# EAGLE design ESPRGBLED (EAGLE 7.4.0)
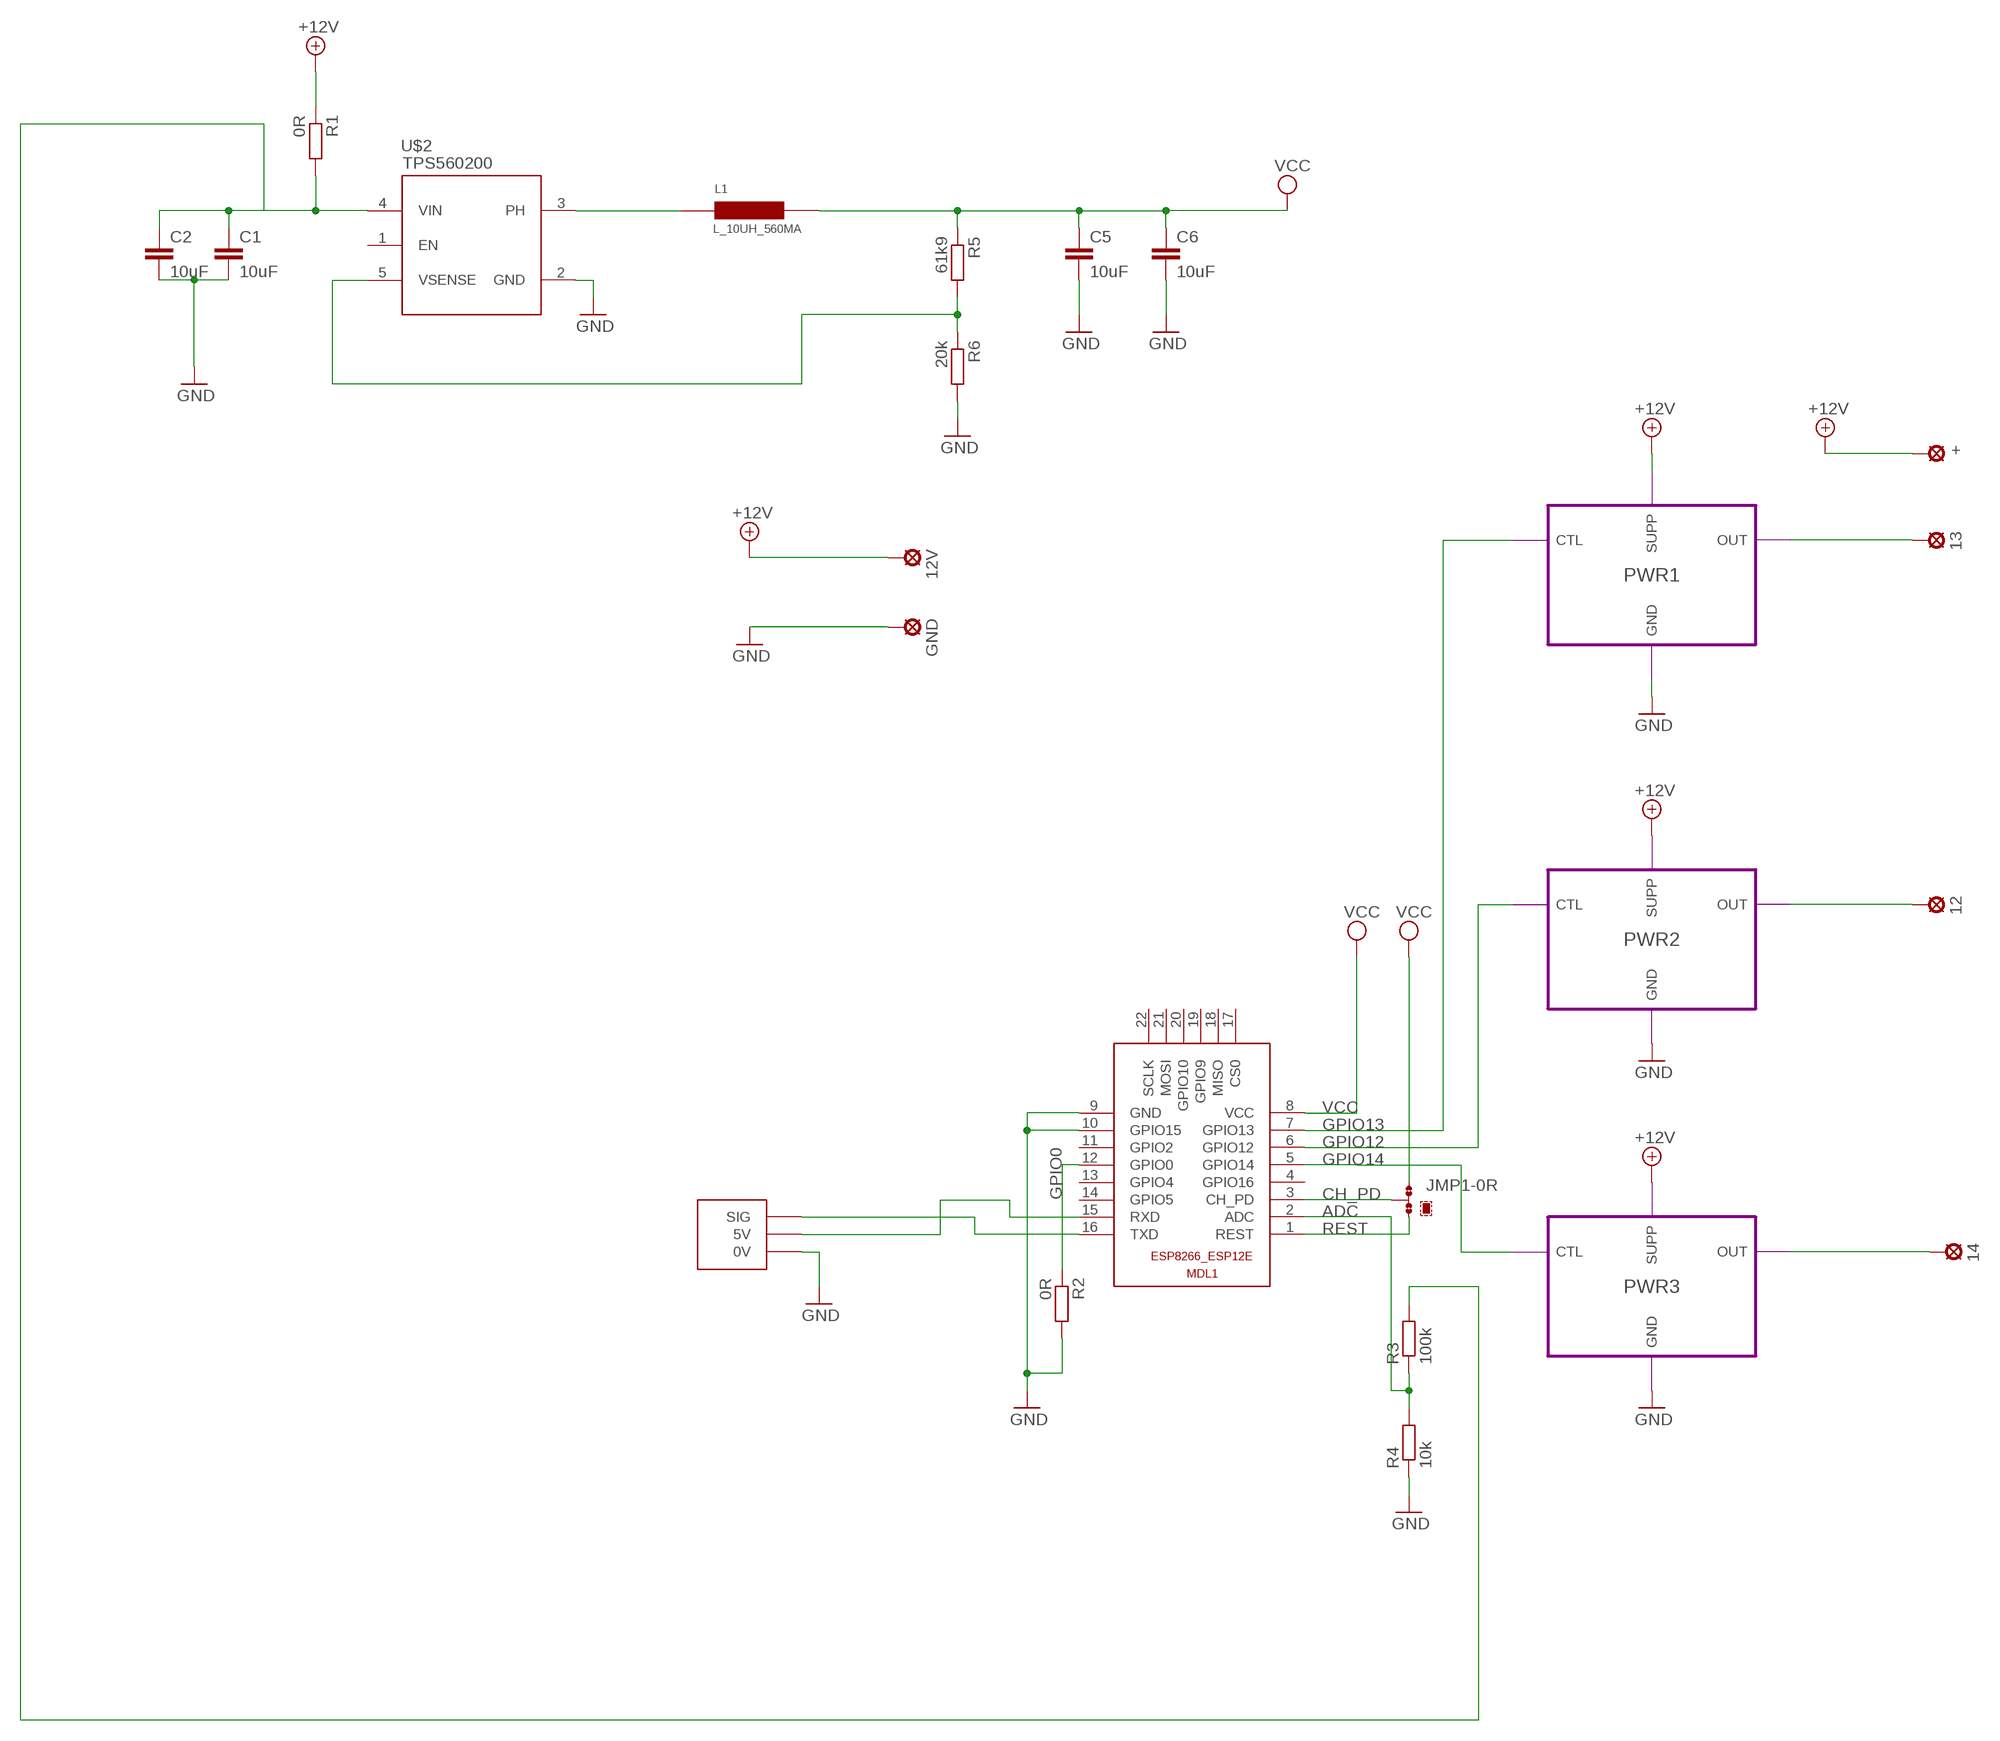
[diagram p0: schematic, sheet 1]

## Parts
12  LSP10  [LSP10]
12V  LSP10  [LSP10]
13  LSP10  [LSP10]
14  LSP10  [LSP10]
+  LSP10  [LSP10]
C1  10uF  C-EUC0805K  [C0805K]
C2  10uF  C-EUC0805K  [C0805K]
C5  10uF  C-EUC0805K  [C0805K]
C6  10uF  C-EUC0805K  [C0805K]
GND  LSP10  [LSP10]
JMP1  0R-JUMPC  [C0R-JMP]
L1  L_10UH_560MA  [TYS3010100M-10]
MDL1  ESP8266-12EESP8266-ESP12E  [ESP8266-ESP12E]
R1  0R  R-EU_R0402  [R0402]
R2  0R  R-EU_R0805  [R0805]
R3  100k  R-EU_R0603  [R0603]
R4  10k  R-EU_R0603  [R0603]
R5  61k9  R-EU_R0402  [R0402]
R6  20k  R-EU_R0402  [R0402]
U$2  TPS560200  [SOT23-5]
U$3  3-WIRE_CONNWIRE  [3-WIRE_CONN]

## Module instances
PWR1 = POWER_N
PWR2 = POWER_N
PWR3 = POWER_N

## Nets
+12V [power]: 12V.MP +.MP R1.1 ; port PWR1.SUPP PWR2.SUPP PWR3.SUPP
ADC: MDL1.2(ADC) R3.1 R4.2
CH_PD: JMP1.2 MDL1.3(CH_PD)
GND: C1.2 C2.2 C5.2 C6.2 GND.MP MDL1.9(GND) MDL1.10(GPIO15) R2.2 R4.1 R6.2 U$2.2(GND) U$3.0V ; port PWR1.GND PWR2.GND PWR3.GND
GPIO0: MDL1.12(GPIO0) R2.1
GPIO12: MDL1.6(GPIO12) ; port PWR2.CTL
GPIO13: MDL1.7(GPIO13) ; port PWR1.CTL
GPIO14: MDL1.5(GPIO14) ; port PWR3.CTL
N$1 [power]: 13.MP ; port PWR1.OUT
N$4 [power]: 12.MP ; port PWR2.OUT
N$5 [power]: 14.MP ; port PWR3.OUT
N$7: MDL1.16(TXD) U$3.SIG
N$8: MDL1.15(RXD) U$3.5V
N$13: L1.P$1 U$2.3(PH)
N$15: R5.2 R6.1 U$2.5(VSENSE)
REST: JMP1.1 MDL1.1(REST)
VCC: C5.1 C6.1 JMP1.3 L1.P$2 MDL1.8(VCC) R5.1
VIN: C1.1 C2.1 R1.2 R3.2 U$2.4(VIN)
Unconnected: MDL1.4(GPIO16) MDL1.11(GPIO2) MDL1.13(GPIO4) MDL1.14(GPIO5) MDL1.17(CS0) MDL1.18(MISO) MDL1.19(GPIO9) MDL1.20(GPIO10) MDL1.21(MOSI) MDL1.22(SCLK) U$2.1(EN)

## Library data of the parts
12 12V 13 14 + GND = solpad:LSP10: SOLDER PAD drill 1.0 mm, distributor Buerklin, 12H555; OC_FARNELL: unknown
C1 C2 C5 C6 = rcl:C-EU: CAPACITOR, European symbol; OC_FARNELL: 1759421
JMP1 = jump-0r-smd:0R-JUMP: SMD 0R 0805 Jumper; OC_FARNELL: unknown
L1 = Fabian:L_10UH_560MA
MDL1 = ESP8266-ESP12E:ESP8266-12E: ESP8266-12E with additional I/O and GPIO04/05 corrected The author cannot warrant that this library is free from error or will meet your specific requirements. Created by PuceBaboon.com. Komagane, Nagano, JAPAN; OC_FARNELL: unknown
R1 R2 = rcl:R-EU_: RESISTOR, European symbol; MF: BOURNS; MPN: CR0603-J/-000ELF; OC_FARNELL: 2467553
R3 = rcl:R-EU_: RESISTOR, European symbol; MF: WELWYN; MPN: ASC0603-10KFT5; OC_FARNELL: 2078921
R4 = rcl:R-EU_: RESISTOR, European symbol; MF: WELWYN; MPN: ASC0603-10KFT5; OC_FARNELL: 2078915RL
R5 R6 = rcl:R-EU_: RESISTOR, European symbol
U$2 = Fabian:TPS560200
U$3 = Fabian:3-WIRE_CONN: three wire solder point; OC_FARNELL: unknown

## Module POWER_N
Ports: CTL(io) OUT(io) GND(io) SUPP(io)
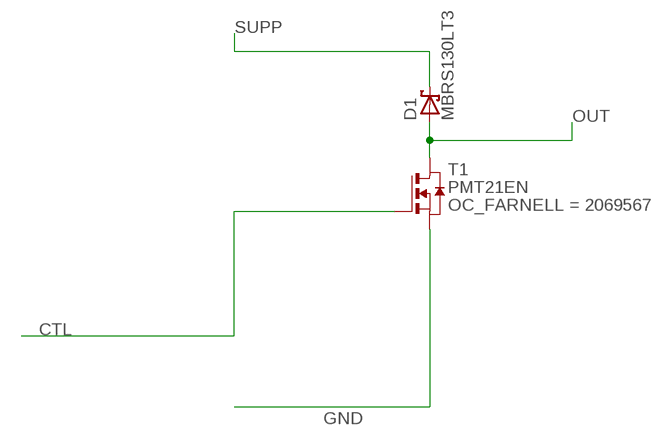
[diagram p1: schematic, module POWER_N, sheet 1]

### Parts
D1  MBRS130LT3  [SMB]
T1  NMOSSOT223  [SOT223]

### Nets
CTL: T1.1(G)
GND [power]: T1.3(S)
OUT [power]: D1.A T1.2(D) T1.4(D)
SUPP [power]: D1.C

### Library data of the parts
D1 = diode:MBRS130LT3: Schottky Power Rectifier Source: http://www.onsemi.com/pub/Collateral/MBRS130LT3-D.PDF; MF: ON SEMICONDUCTOR; MPN: MBRS130LT3G; OC_FARNELL: 2125539
T1 = zetex:NMOSSOT223: MOS FET; MF: NXP; MPN: PMT21EN; OC_FARNELL: 2069567; OC_NEWARK: unknown

## Net classes
1 power: width 0.8 mm

## Board
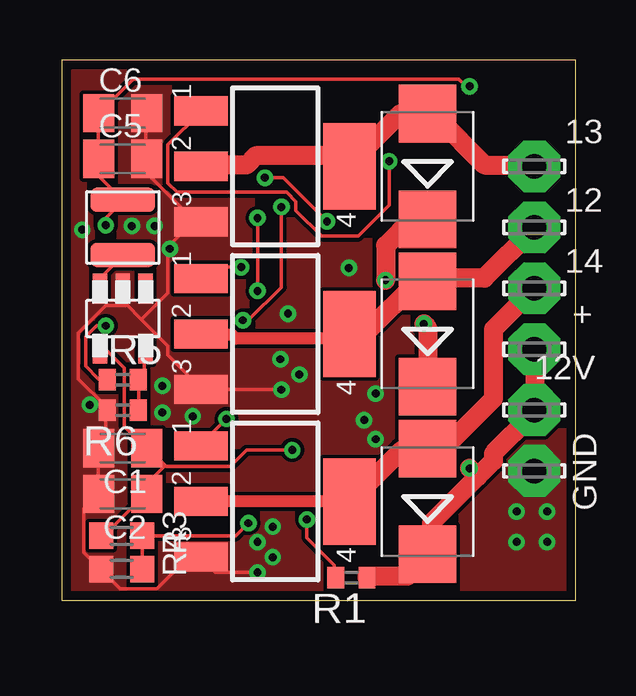
[diagram p2: board, top side]
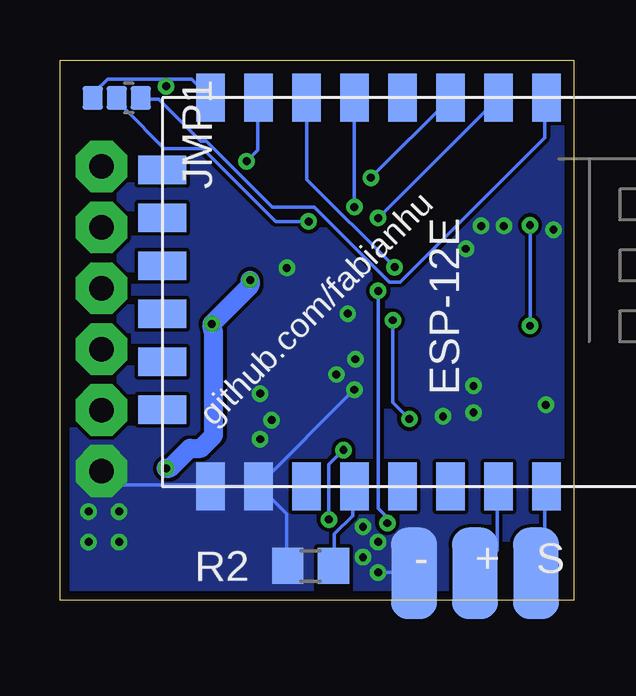
[diagram p3: board, bottom side, seen from below]

Size 21.41 x 22.54 mm. Coordinates in mm from the lower left corner, seen from the top.
Outline: 0,0 21.41,0 21.41,22.54 0,22.54 0,0
Copper layers (1*16): Top 0.0356mm / dielectric 1.5011mm / Bottom 0.0356mm
Design rules "OSHpark-LaenPCBOrder *": minimum track width 6mil, minimum drill 13mil, track to track 6mil, track to pad 6mil, pad to pad 6mil, via to via 6mil, smd to smd 6mil, copper to edge 15mil, drill to drill 6mil, minimum pad ring 7mil, minimum via ring 7mil, stop-mask expansion 3mil, vias tented up to drill 20mil, thermal gap 10mil

### Footprints (pad centres in the part's own frame; a part is rotated, then mirrored left to right if it is on the bottom)
LSP10 = drill 1.016 pad 2.159 octagon: MP 0,0
C0805K = smd 1.3 x 1.6: 1 -1,0; 2 1,0
C0R-JMP = smd 1 x 0.85: 1 0,1; 2 0,0; 3 0,-1
TYS3010100M-10 = smd 1 x 2.7: P$1 -1.15,0; P$2 1.15,0
ESP8266-ESP12E = smd 2 x 1.2: 1 0,16; 2 0,14; 3 0,12; 4 0,10; 5 0,8; 6 0,6; 7 0,4; 8 0,2; 9 16.2,2; 10 16.2,4; 11 16.2,6; 12 16.2,8; 13 16.2,10; 14 16.2,12; 15 16.2,14; 16 16.2,16 | smd 1.2 x 2: 17 11,0; 18 3,0; 19 5,0; 20 13,0; 21 7,0; 22 9,0
SMB = smd 2.4 x 2.4: A 2.2,0; C -2.2,0
SOT223 = smd 1.219 x 2.235: 1 -2.311,-3.099; 2 0,-3.099; 3 2.311,-3.099 | smd 3.6 x 2.2: 4 0,3.099
R0402 = smd 0.7 x 0.9: 1 -0.65,0; 2 0.65,0
R0805 = smd 1.3 x 1.5: 1 -0.95,0; 2 0.95,0
R0603 = smd 1 x 1.1: 1 -0.85,0; 2 0.85,0
SOT23-5 = smd 0.6 x 1.05: 1 -0.95,-1.35; 2 0,-1.35; 3 0.95,-1.35; 4 0.95,1.35; 5 -0.95,1.35
3-WIRE_CONN = smd 1.905 x 3.81: 0V -2.54,0; 5V 0,0; SIG 2.54,0

### Placement (x,y rotation side)
12  19.68,15.56 0 top
12V  19.68,7.94 0 top
13  19.68,18.1 0 top
14  19.68,13.02 0 top
+  19.68,10.48 0 top
C1  2.54,6.35 180 top
C2  2.54,4.45 180 top
C5  2.54,18.41 0 top
C6  2.54,20.32 0 top
GND  19.68,5.4 0 top
JMP1  19.05,20.96 270 bottom
L1  2.54,15.56 90 top
MDL1  17.14,20.96 270 bottom
PWR1:D1  MBRS130LT3  [SMB]  15.24,18.1 90 top
PWR1:T1  [SOT223]  8.89,18.1 270 top
PWR2:D1  MBRS130LT3  [SMB]  15.24,11.11 90 top
PWR2:T1  [SOT223]  8.89,11.11 270 top
PWR3:D1  MBRS130LT3  [SMB]  15.24,4.13 90 top
PWR3:T1  [SOT223]  8.89,4.13 270 top
R1  12.06,0.95 180 top
R2  10.97,1.44 180 bottom
R3  2.5,2.7 180 top
R4  2.5,1.31 0 top
R5  2.54,9.21 0 top
R6  2.54,7.94 180 top
U$2  2.54,11.75 180 top
U$3  4.12,1.13 0 bottom

### Tracks (layer width: path | path; a pad name or v marks a point on that pad's centre or on a via)
+12V  (via drill 0.33)
  Top 0.5: 19.74,10.46 +.MP | 19.74,8.18 12V.MP
  Top 0.8: 19.74,8.18 19.74,10.46 | v15.09,11.53 15.24,11.38 15.24,8.94 PWR2:D1.C | v13.49,13.36 13.49,14.81 14.55,15.88 15.24,15.88 PWR1:D1.C | R1.1 12.72,1.02 14.4,1.02 15.24,1.85 PWR3:D1.C 15.39,2.31 15.39,3.23 17.34,5.17 | 17.34,5.17 17.98,5.82 17.98,6.12 19.58,7.72 12V.MP | v16.99,5.51 17.07,5.44 17.34,5.17
  Bottom 0.8: v13.49,13.36 13.49,13.13 v15.09,11.53 15.01,11.15 15.01,6.88 15.54,6.35 16,6.35 16.84,5.51 v16.99,5.51
ADC  (via drill 0.33)
  Top 0.152: R4.2 3.35,1.32 R3.1 3.43,2.69 7.24,2.69 v7.77,3.23 | v8.15,15.95 v8.15,12.9
  Bottom 0.152: v7.77,3.23 7.77,3.45 8.15,3.84 v8.15,12.9 | v8.15,15.95 3.2,20.9 MDL1.2
CH_PD  (via drill 0.33)
  Top 0.152: v11.05,15.8 9.22,17.63 v8.46,17.63
  Bottom 0.152: v11.05,15.8 12.42,15.8 15.47,18.85 17.07,18.85 18.75,20.52 18.75,20.6 19.05,20.9 JMP1.2 | v8.46,17.63 5.18,20.9 MDL1.3
GND  (via drill 0.33)
  Top 0.152: 1.52,4.45 0.91,3.84 0.91,2.01 1.6,1.32 R4.1 1.68,1.25 2.44,0.48 3.96,0.48 5.26,1.78 5.79,1.78 | 1.52,4.45 C2.2 1.52,4.45 | 1.52,4.45 1.52,6.35 C1.2 1.6,6.35 1.83,6.58 1.83,7.87 R6.2 1.83,7.95 1.83,8.1 0.69,9.25 0.69,11.15 1.83,12.29 2.67,12.29 2.71,12.33 | 5.79,1.78 PWR3:T1.3 5.79,1.78 | v8.15,1.17 6.4,1.17 5.79,1.78 | 3.31,11.72 4.42,10.62 4.42,10.24 5.79,8.87 PWR2:T1.3 5.79,8.79 v9.14,8.79 | 3.31,11.72 2.71,12.33 | 2.71,12.33 2.59,12.45 2.59,13.06 U$2.2 | C6.2 3.5,20.3 3.5,18.47 C5.2 3.58,18.39 3.58,17.78 5.56,15.8 PWR1:T1.3 5.49,15.8 4.42,14.73 4.42,12.83 3.35,11.76 3.31,11.72
  Bottom 0.152: R2.2 11.96,1.47 11.96,3.61 13.11,4.75 MDL1.10 | MDL1.10 13.18,4.75 15.09,4.75 MDL1.9 15.16,4.83 19.13,4.83 19.66,5.36 GND.MP | v8.15,1.17 6.71,1.17 U$3.0V | v9.14,8.79 13.11,4.83 MDL1.10
  other vias: 20.22,3.71 18.95,3.71 18.95,2.44 20.22,2.44 8.15,2.44 1.17,8.15 8.79,1.8 8.79,3.07 4.18,7.84 4.18,8.95 5.45,7.68 9.11,10.06 9.9,9.42 13.07,8.63 13.07,6.72 11.96,13.87 9.42,11.96 12.6,7.52 2.91,15.61 3.87,15.61 4.5,14.66 0.85,15.46
  pour Bottom (no thermals): 21.59,22.23 0,22.23 0,0 21.59,0
  pour Top (no thermals): 0,22.23 21.59,22.23 21.59,0 0,0
GPIO0
  Bottom 0.152: R2.1 9.98,1.47 9.98,2.77 9.22,3.53 9.22,4.75 MDL1.12
GPIO12  (via drill 0.33)
  Top 0.152: v7.47,13.89 6.25,13.89 5.79,13.44 PWR2:T1.1
  Bottom 0.152: v7.47,13.89 11.12,17.55 11.12,20.9 MDL1.6
GPIO13  (via drill 0.33)
  Top 0.152: v13.64,18.31 13.64,16.48 12.34,15.19 10.82,15.19 9.75,16.26 9.75,16.64 9.37,17.02 4.8,17.02 4.42,17.4 4.42,19 5.79,20.37 PWR1:T1.1
  Bottom 0.152: v13.64,18.31 13.18,18.77 13.18,20.9 MDL1.7
GPIO14  (via drill 0.33)
  Top 0.152: v9.14,16.41 9.14,13.06 7.77,11.68 v7.54,11.68 | v6.86,7.57 5.79,6.5 PWR3:T1.1
  Bottom 0.152: v9.14,16.41 9.14,20.9 MDL1.5 | v7.54,11.68 7.54,8.26 v6.86,7.57
N$1
  Top 0.8: PWR1:T1.2 5.79,18.16 7.7,18.16 8.08,18.54 11.58,18.54 11.96,18.16 PWR1:T1.4 12.27,18.47 14.1,20.3 PWR1:D1.A 15.62,20.14 17.6,18.16 19.66,18.16 13.MP
N$4
  Top 0.5: PWR2:T1.2 5.79,11.07 7.09,11.07 7.24,10.92 11.81,10.92 11.96,11.07 PWR2:T1.4
  Top 0.8: PWR2:T1.4 12.19,11.23 12.72,11.23 14.78,13.28 15.24,13.28 PWR2:D1.A 15.62,13.44 17.6,13.44 19.66,15.49 12.MP
N$5
  Top 0.5: PWR3:T1.2 11.96,4.14 PWR3:T1.4
  Top 0.8: PWR3:T1.4 12.19,4.29 14.17,6.27 15.24,6.27 PWR3:D1.A 15.62,6.5 16.08,6.5 17.98,8.41 17.98,11.3 19.66,12.98 14.MP
N$7
  Bottom 0.152: MDL1.16 1.22,4.75 1.22,1.47 1.52,1.17 U$3.SIG
N$8
  Bottom 0.152: MDL1.15 3.2,4.75 3.2,2.08 4.12,1.17 U$3.5V
N$13
  Top 0.152: U$2.3 1.6,13.13 1.6,13.44 2.52,14.35 L1.P$1
N$15
  Top 0.152: R6.1 3.2,9.17 R5.2 3.2,9.25 3.43,9.47 3.43,10.39 U$2.5
REST
  Bottom 0.152: JMP1.1 18.06,20.9 17.3,20.9 15.54,19.15 15.32,19.15 12.57,16.41 10.82,16.41 7.7,13.28 7.24,13.28 1.22,19.3 1.22,20.9 MDL1.1
VCC  (via drill 0.33)
  Top 0.152: v1.83,11.46 1.45,11.46 0.99,11 0.99,9.78 1.52,9.25 1.83,9.25 R5.1 | v1.83,15.65 1.83,15.95 2.52,16.64 L1.P$2 2.52,16.71 1.6,17.63 1.6,18.39 C5.1 1.52,18.47 1.52,20.3 C6.1 1.6,20.37 2.97,21.74 16.54,21.74 16.84,21.44 v16.99,21.44
  Bottom 0.152: 16.99,21.74 15.93,21.74 15.16,20.98 MDL1.8 | 16.99,21.74 19.43,21.74 19.96,21.21 19.96,20.98 JMP1.3 | v1.83,15.65 v1.83,11.46 | v16.99,21.44 16.99,21.74
VIN  (via drill 0.33)
  Top 0.152: R3.2 1.68,2.77 1.83,2.77 3.5,4.45 C2.1 3.58,4.45 3.58,4.9 4.27,5.59 4.3,5.63 | v10.21,3.38 10.21,2.62 11.35,1.47 11.35,1.02 R1.2 | v9.6,6.27 7.7,6.27 7.01,5.59 4.34,5.59 4.3,5.63 | 4.3,5.63 3.58,6.35 C1.1 3.5,6.35 2.59,7.26 2.59,9.7 1.91,10.39 U$2.4
  Bottom 0.152: v10.21,3.38 10.21,5.66 v9.6,6.27

### Text on the board
bPlace: github.com/fabianhu